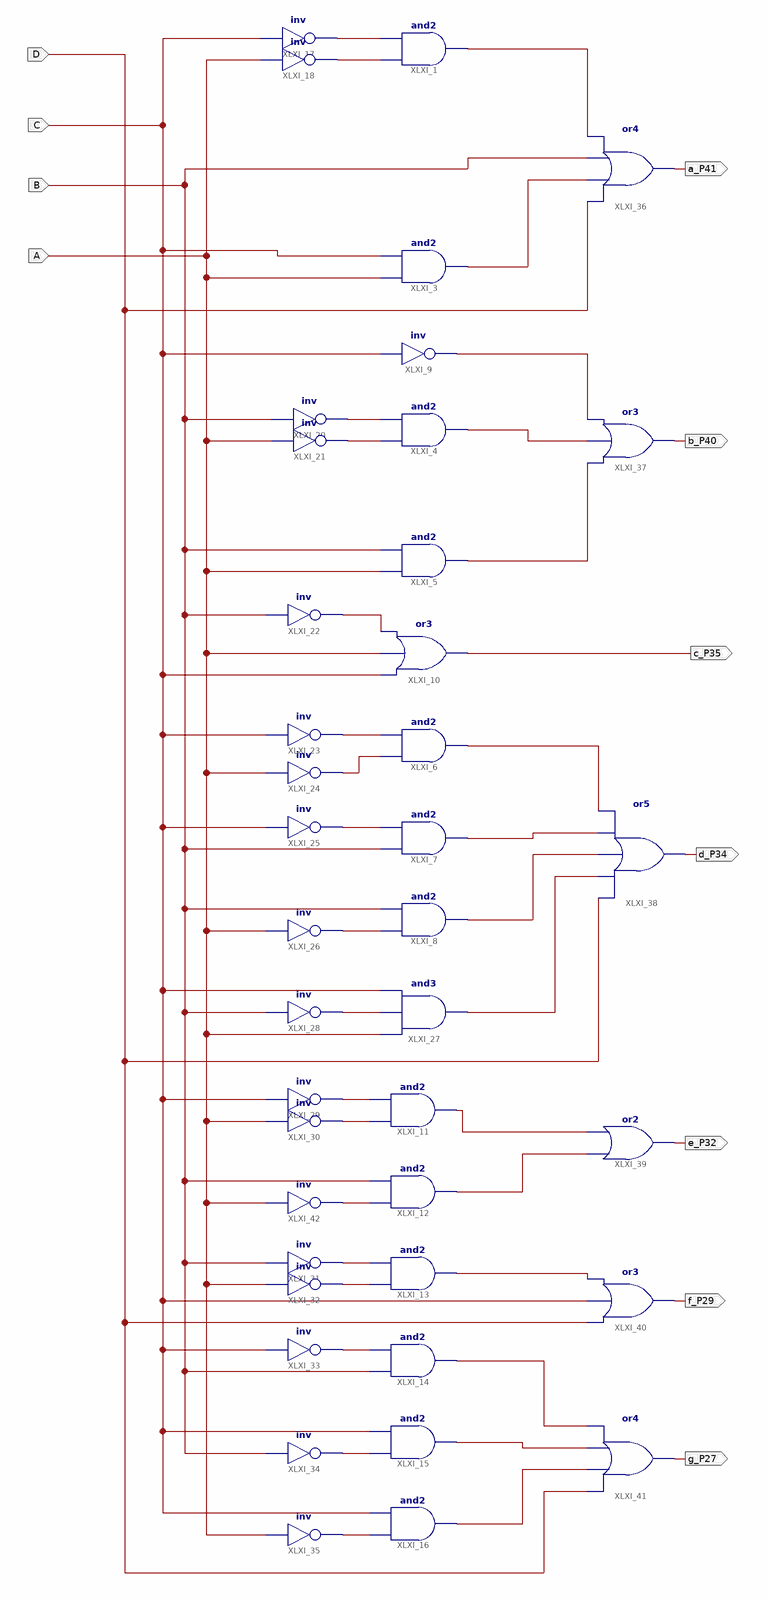
[diagram p0: schematic sheet 1]
// Xilinx ISE schematic sevenseg.sch (spartan6) as structural Verilog: 40 symbols, 11 ports
module sevenseg (
  input  C,
  input  B,
  input  A,
  input  D,
  output a_P41,
  output b_P40,
  output c_P35,
  output d_P34,
  output e_P32,
  output f_P29,
  output g_P27
);

  wire XLXN_4, XLXN_5, XLXN_6, XLXN_8, XLXN_9, XLXN_10, XLXN_11, XLXN_12, XLXN_13, XLXN_14, XLXN_15, XLXN_16,
       XLXN_17, XLXN_18, XLXN_19, XLXN_20, XLXN_21, XLXN_22, XLXN_23, XLXN_25, XLXN_27, XLXN_28, XLXN_29,
       XLXN_30, XLXN_31, XLXN_32, XLXN_34, XLXN_35, XLXN_36, XLXN_37, XLXN_38, XLXN_39, XLXN_40;

  and XLXI_1 (XLXN_23, XLXN_5, XLXN_4);
  and XLXI_3 (XLXN_25, A, C);
  and XLXI_4 (XLXN_28, XLXN_10, XLXN_9);
  and XLXI_5 (XLXN_29, A, B);
  and XLXI_6 (XLXN_30, XLXN_13, XLXN_12);
  and XLXI_7 (XLXN_31, B, XLXN_14);
  and XLXI_8 (XLXN_32, XLXN_15, B);
  not XLXI_9 (XLXN_27, C);
  or XLXI_10 (c_P35, C, A, XLXN_11);
  and XLXI_11 (XLXN_35, XLXN_18, XLXN_17);
  and XLXI_12 (XLXN_36, XLXN_19, B);
  and XLXI_13 (XLXN_37, XLXN_21, XLXN_20);
  and XLXI_14 (XLXN_38, B, XLXN_22);
  and XLXI_15 (XLXN_39, XLXN_8, C);
  and XLXI_16 (XLXN_40, XLXN_6, C);
  not XLXI_17 (XLXN_4, C);
  not XLXI_18 (XLXN_5, A);
  not XLXI_20 (XLXN_9, B);
  not XLXI_21 (XLXN_10, A);
  not XLXI_22 (XLXN_11, B);
  not XLXI_23 (XLXN_12, C);
  not XLXI_24 (XLXN_13, A);
  not XLXI_25 (XLXN_14, C);
  not XLXI_26 (XLXN_15, A);
  and XLXI_27 (XLXN_34, A, XLXN_16, C);
  not XLXI_28 (XLXN_16, B);
  not XLXI_29 (XLXN_17, C);
  not XLXI_30 (XLXN_18, A);
  not XLXI_31 (XLXN_20, B);
  not XLXI_32 (XLXN_21, A);
  not XLXI_33 (XLXN_22, C);
  not XLXI_34 (XLXN_8, B);
  not XLXI_35 (XLXN_6, A);
  or XLXI_36 (a_P41, D, XLXN_25, B, XLXN_23);
  or XLXI_37 (b_P40, XLXN_29, XLXN_28, XLXN_27);
  or XLXI_38 (d_P34, D, XLXN_34, XLXN_32, XLXN_31, XLXN_30);
  or XLXI_39 (e_P32, XLXN_36, XLXN_35);
  or XLXI_40 (f_P29, D, C, XLXN_37);
  or XLXI_41 (g_P27, D, XLXN_40, XLXN_39, XLXN_38);
  not XLXI_42 (XLXN_19, A);
endmodule
